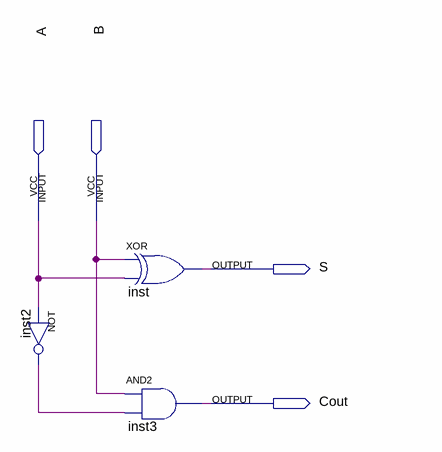
[diagram p0: schematic sheet]
// Quartus schematic MeioSubtrator.bdf as structural Verilog: 3 symbols, 4 pins
module MeioSubtrator (
  input  A,
  input  B,
  output S,
  output Cout
);

  wire inst2_out;

  not inst2 (inst2_out, A);
  xor inst (S, B, A);
  and inst3 (Cout, B, inst2_out);
endmodule
